# Altium schematic sheet sheet3.SchDoc
size A4
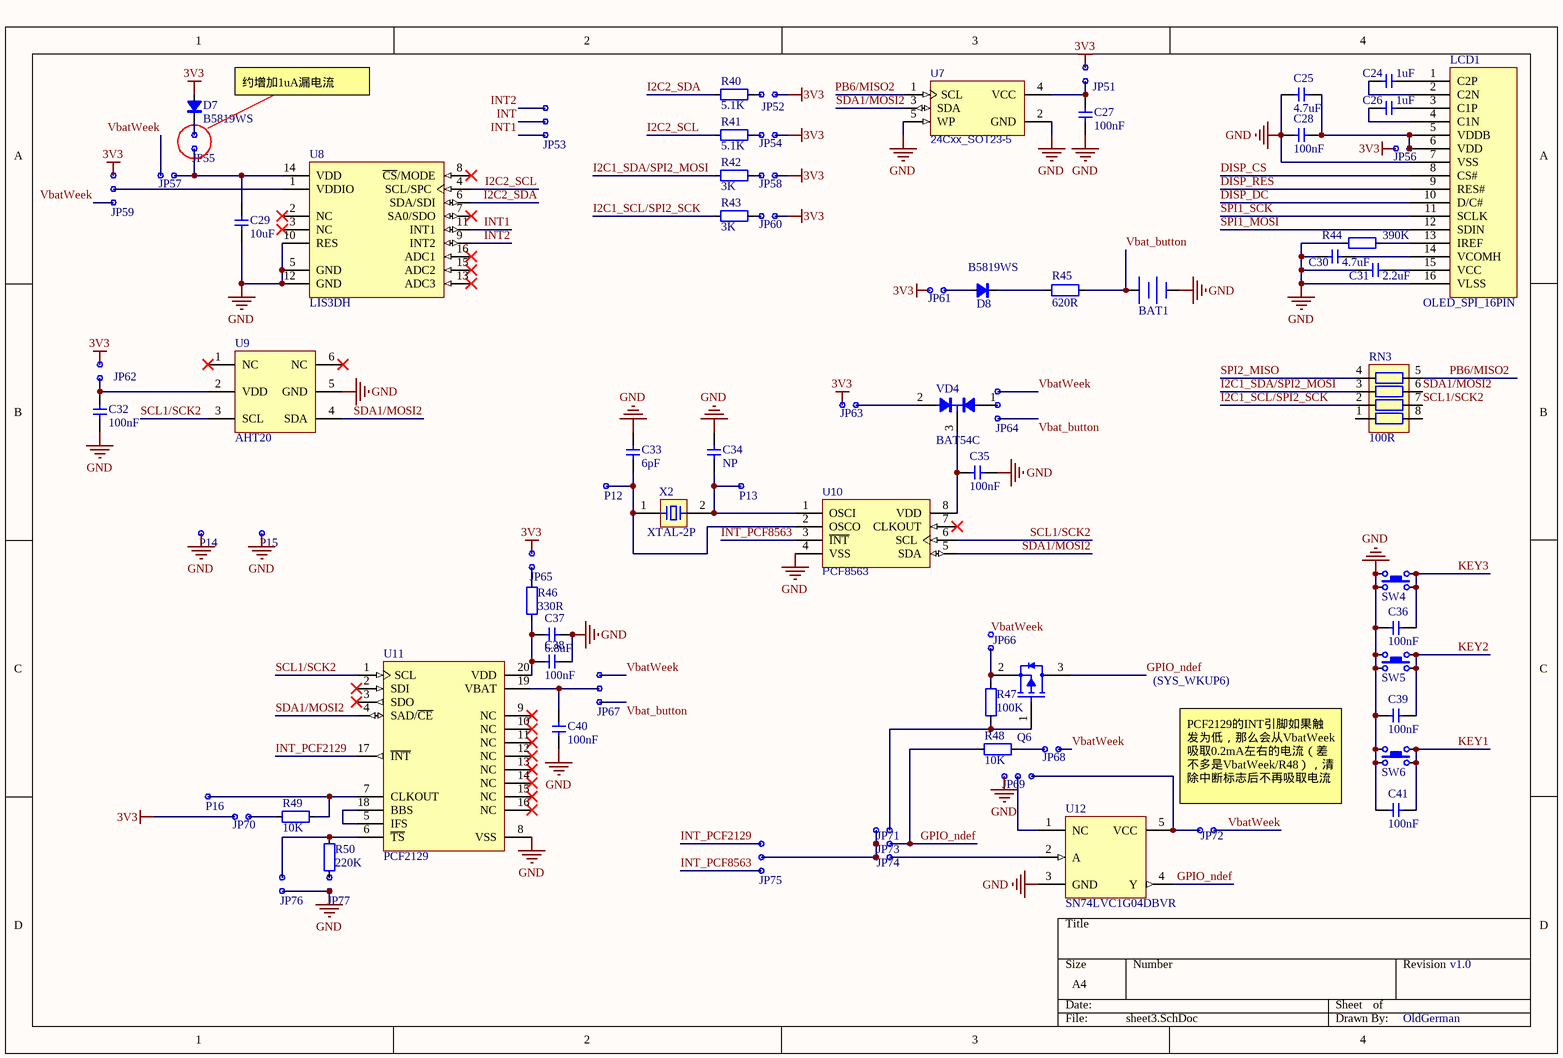
[diagram p0: sheet3.SchDoc]

## Parts
BAT1  BAT  [MS621FE-FL11E]  (value not drawn)
C24  1uF  [C0603]
C25  4.7uF  [C0603]
C26  1uF  [C0603]
C27  100nF  [C0603]
C28  100nF  [C0603]
C29  10uF  [C0603]
C30  4.7uF  [C0603]
C31  2.2uF  [C0603]
C32  100nF  [C0603]
C33  6pF  [C0603]
C34  NP  [C0603]
C35  100nF  [C0603]
C36  100nF  [C0603]
C37  6.8uF  [C0603]
C38  100nF  [C0603]
C39  100nF  [C0603]
C40  100nF  [C0603]
C41  100nF  [C0603]
D7  B5819WS  [SOD-323]
D8  B5819WS  [SOD-323]
JP51  CONN_X2_DOT  [2.54mm_Male_x2]  (value not drawn)
JP52  CONN_X2_DOT  [2.54mm_Male_x2]  (value not drawn)
JP53  CONN_X3_DOT  [2.54mm_Male_x3]  (value not drawn)
JP54  CONN_X2_DOT  [2.54mm_Male_x2]  (value not drawn)
JP55  CONN_X2_DOT  [2.54mm_Male_x2]  (value not drawn)
JP56  CONN_X2_DOT  [2.54mm_Male_x2]  (value not drawn)
JP57  CONN_X2_DOT  [2.54mm_Male_x2]  (value not drawn)
JP58  CONN_X2_DOT  [2.54mm_Male_x2]  (value not drawn)
JP59  CONN_X3_DOT  [2.54mm_Male_x3]  (value not drawn)
JP60  CONN_X2_DOT  [2.54mm_Male_x2]  (value not drawn)
JP61  CONN_X2_DOT  [2.54mm_Male_x2]  (value not drawn)
JP62  CONN_X2_DOT  [2.54mm_Male_x2]  (value not drawn)
JP63  CONN_X2_DOT  [2.54mm_Male_x2]  (value not drawn)
JP64  CONN_X3_DOT  [2.54mm_Male_x3]  (value not drawn)
JP65  CONN_X2_DOT  [2.54mm_Male_x2]  (value not drawn)
JP66  CONN_X2_DOT  [2.54mm_Male_x2]  (value not drawn)
JP67  CONN_X3_DOT  [2.54mm_Male_x3]  (value not drawn)
JP68  CONN_X2_DOT  [2.54mm_Male_x2]  (value not drawn)
JP69  CONN_X3_DOT  [2.54mm_Male_x3]  (value not drawn)
JP70  CONN_X2_DOT  [2.54mm_Male_x2]  (value not drawn)
JP71  CONN_X2_DOT  [2.54mm_Male_x2]  (value not drawn)
JP72  CONN_X2_DOT  [2.54mm_Male_x2]  (value not drawn)
JP73  CONN_X2_DOT  [2.54mm_Male_x2]  (value not drawn)
JP74  CONN_X2_DOT  [2.54mm_Male_x2]  (value not drawn)
JP75  CONN_X3_DOT  [2.54mm_Male_x3]  (value not drawn)
JP76  CONN_X2_DOT  [2.54mm_Male_x2]  (value not drawn)
JP77  CONN_X2_DOT  [2.54mm_Male_x2]  (value not drawn)
LCD1  OLED_SPI_16PIN  [oled_64x48_0.66_SSD1306_TOP_straight_no_3d]
P12  CONN_X1_DOT  [2.54mm_Male_x1]  (value not drawn)
P13  CONN_X1_DOT  [2.54mm_Male_x1]  (value not drawn)
P14  CONN_X1_DOT  [2.54mm_Male_x1]  (value not drawn)
P15  CONN_X1_DOT  [2.54mm_Male_x1]  (value not drawn)
P16  CONN_X1_DOT  [2.54mm_Male_x1]  (value not drawn)
Q6  P-MOS  [INFINEON SOT-23-3]  (value not drawn)
R40  5.1K  [R0603]
R41  5.1K  [R0603]
R42  3K  [R0603]
R43  3K  [R0603]
R44  390K  [R0603]
R45  620R  [R0603]
R46  330R  [R0603]
R47  100K  [R0603]
R48  10K  [R0603]
R49  10K  [R0603]
R50  220K  [R0603]
RN3  100R  [RESNET 1206-8 CONCAVE]
SW4  Button-4P  [SWITCH_3X4X2.5_4PIN_SMD]  (value not drawn)
SW5  Button-4P  [SWITCH_3X4X2.5_4PIN_SMD]  (value not drawn)
SW6  Button-4P  [SWITCH_3X4X2.5_4PIN_SMD]  (value not drawn)
U7  24Cxx_SOT23-5  [MICROCHIP SOT-23-5 OT]
U8  LIS3DH  [LGA-16-3X3]
U9  AHT20  [AHT20]
U10  PCF8563  [ANALOG DEV SOIC-8 R8]
U11  PCF2129  [NXP_SO20]
U12  SN74LVC1G04DBVR  [TI SOT-23-5 DBV]
VD4  BAT54C  [INFINEON SOT-23-3]
X2  XTAL-2P  [XTAL_2P_3215]

## Nets
3V3: D7.1(A) JP51.1 JP52.2 JP54.2 JP56.1 JP58.2 JP59.1 JP60.2 JP61.1 JP62.1 JP63.1 JP65.1 JP70.1
GND: BAT1.2(-) C25.2 C27.2 C28.1 C29.2 C30.2 C31.2 C32.2 C33.1 C34.1 C35.2 C36.1 C37.2 C38.2 C39.1 C40.2 C41.1 JP69.1 JP76.2 JP77.2 LCD1.7(VSS) LCD1.16(VLSS) P14.1 P15.1 R44.1 SW4.1 SW4.2 SW5.1 SW5.2 SW6.1 SW6.2 U7.2(GND) U7.5(WP) U8.5(GND) U8.10(RES) U8.12(GND) U9.5(GND) U10.4(VSS) U11.8(VSS) U12.3(GND)
DISP_CS: LCD1.8(CS#)
DISP_DC: LCD1.10(D/C#)
DISP_RES: LCD1.9(RES#)
GPIO_ndef: JP73.2 Q6.3(D) R48.2 U12.4(Y)
I2C1_SCL/SPI2_SCK: R43.2 RN3.2
I2C1_SDA/SPI2_MOSI: R42.2 RN3.3
I2C2_SCL: R41.2 U8.4(SCL/SPC)
I2C2_SDA: R40.2 U8.6(SDA/SDI)
INT: JP53.2
INT1: JP53.3 U8.11(INT1)
INT2: JP53.1 U8.9(INT2)
INT_PCF2129: JP75.1 U11.17(~{INT})
INT_PCF8563: JP75.3 U10.3(~{INT})
KEY1: C41.2 SW6.3 SW6.4
KEY2: C39.2 SW5.3 SW5.4
KEY3: C36.2 SW4.3 SW4.4
PB6/MISO2: RN3.5 U7.1(SCL)
SCL1/SCK2: RN3.7 U9.3(SCL) U10.6(SCL) U11.1(SCL)
SDA1/MOSI2: RN3.6 U7.3(SDA) U9.4(SDA) U10.5(SDA) U11.4(SAD/~{CE})
SPI1_MOSI: LCD1.12(SDIN)
SPI1_SCK: LCD1.11(SCLK)
SPI2_MISO: RN3.4
Vbat_button: BAT1.1(+) JP64.3 JP67.3 R45.2
VbatWeek: JP57.1 JP59.3 JP64.1 JP66.1 JP67.1 JP68.2 JP72.2
NetC24_1: C24.1 LCD1.1(C2P)
NetC24_2: C24.2 LCD1.2(C2N)
NetC25_1: C25.1 C28.2 JP56.2 LCD1.5(VDDB) LCD1.6(VDD)
NetC26_1: C26.1 LCD1.3(C1P)
NetC26_2: C26.2 LCD1.4(C1N)
NetC27_1: C27.1 JP51.2 U7.4(VCC)
NetC29_1: C29.1 JP55.2 JP57.2 U8.14(VDD)
NetC30_1: C30.1 LCD1.14(VCOMH)
NetC31_1: C31.1 LCD1.15(VCC)
NetC32_1: C32.1 JP62.2 U9.2(VDD)
NetC33_2: C33.2 P12.1 U10.2(OSCO) X2.1
NetC34_2: C34.2 P13.1 U10.1(OSCI) X2.2
NetC35_1: C35.1 U10.8(VDD) VD4.3
NetC37_1: C37.1 C38.1 R46.1 U11.20(VDD)
NetC40_1: C40.1 JP67.2 U11.19(VBAT)
NetD7_2: D7.2(C) JP55.1
NetD8_1: D8.1(A) JP61.2
NetD8_2: D8.2(C) R45.1
NetJP52_1: JP52.1 R40.1
NetJP54_1: JP54.1 R41.1
NetJP58_1: JP58.1 R42.1
NetJP59_2: JP59.2 U8.1(VDDIO)
NetJP60_1: JP60.1 R43.1
NetJP63_2: JP63.2 VD4.2
NetJP64_2: JP64.2 VD4.1
NetJP65_2: JP65.2 R46.2
NetJP66_2: JP66.2 Q6.2(S) R47.2
NetJP68_1: JP68.1 R48.1
NetJP69_2: JP69.2 U12.1(NC)
NetJP69_3: JP69.3 JP72.1 U12.5(VCC)
NetJP70_2: JP70.2 R49.2
NetJP71_1: JP71.1 JP73.1 JP74.1 JP75.2
NetJP71_2: JP71.2 Q6.1(G) R47.1
NetJP74_2: JP74.2 U12.2(A)
NetJP76_1: JP76.1 R50.2 U11.6(~{TS})
NetJP77_1: JP77.1 R50.1
NetLCD1_13: LCD1.13(IREF) R44.2
NetP16_1: P16.1 R49.1 U11.7(CLKOUT)
NetU11_5: U11.5(IFS) U11.18(BBS)

Not connected (* = marked no-connect by the designer): RN3 1 8; U8 2(NC)* 3(NC)* 7(SA0/SDO)* 8(~{CS}/MODE)* 13(ADC3)* 15(ADC2)* 16(ADC1)*; U9 1(NC)* 6(NC)*; U10 7(CLKOUT)*; U11 2(SDI)* 3(SDO)* 9(NC)* 10(NC)* 11(NC)* 12(NC)* 13(NC)* 14(NC)* 15(NC)* 16(NC)*

## Notes on the sheet
- 约增加1uA漏电流
  (肖特基具有反向漏电流偏大的特点)
- (near Q6) (SYS_WKUP6)
- PCF2129的INT引脚如果触发为低，那么会从VbatWeek吸取0.2mA左右的电流（差不多是VbatWeek/R48），清除中断标志后不再吸取电流
- v1.0
- OldGerman

## Library data of the parts
BAT1 = BAT: 锂电池; Auther: JonesLee; Value: BAT; Publish: 11-4-2017
C24-C41 = CAP: Capacitor; Value: 0.1u
D7 D8 = DIODE: 二极管
Q6 = P-MOS_123
R40-R50 = RES: Resistor; Value: 22R
RN3 = RES-8P4R: 贴片网络排阻; 版权归属: 源创客; BOM名称: 贴片网络排阻; 学习资源: www.ooocke.com
SW4-SW6 = Button-4P: Button
U8 = LIS3DH: The LIS3DH is an ultra-low-power highperformance three-axis linear accelerometer belonging to the “nano” family, with digital I2C/SPI serial interface standard output. The device features ultra-low-power operational modes that allow advanced power saving and smart embedded functions.; ComponentLink1Description: Datasheet; ComponentLink1URL: https://www.bosch-sensortec.com/media/boschsensortec/downloads/datasheets/bst-bmi160-ds000.pdf
U9 = AHT20: 线性稳压芯片; BOM名称: 可调升压芯片; 版权归属: 源创客; 学习资源: www.ooocke.com
U11 = PCF2129: RTC
U12 = SN74LVC1G04DBVR: IC GATE NOT
VD4 = BAT54C: 贴片肖特基二极管; BOM名称: 肖特基二极管; 版权归属: 源创客; 属性: 30V/0.2A; 学习资源: www.ooocke.com
X2 = XTAL-2P: 2脚无源石英晶振; BOM名称: 4脚无源晶振; 版权归属: 源创客; 学习资源: www.ooocke.com